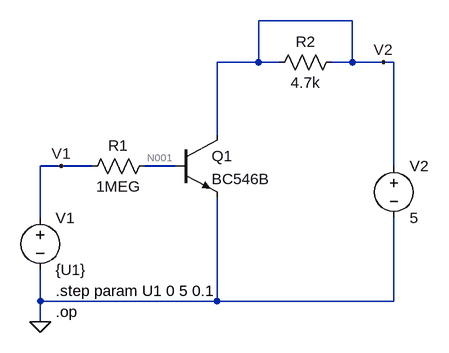
[diagram p0: schematic 1_Ic-Uce-characteristics_nolabels.asc]
1_Ic-Uce-characteristics_nolabels.asc, the LTspice schematic file:
Version 4
SHEET 1 1108 680
WIRE 672 -176 528 -176
WIRE 528 -112 528 -176
WIRE 528 -112 464 -112
WIRE 560 -112 528 -112
WIRE 672 -112 672 -176
WIRE 672 -112 640 -112
WIRE 720 -112 672 -112
WIRE 736 -112 720 -112
WIRE 464 0 464 -112
WIRE 224 48 192 48
WIRE 272 48 224 48
WIRE 400 48 352 48
WIRE 736 48 736 -112
WIRE 192 128 192 48
WIRE 192 256 192 208
WIRE 464 256 464 96
WIRE 464 256 192 256
WIRE 736 256 736 128
WIRE 736 256 464 256
WIRE 192 288 192 256
FLAG 192 288 0
FLAG 224 48 V1
FLAG 720 -112 V2
SYMBOL voltage 192 112 R0
WINDOW 123 0 0 Left 2
WINDOW 39 0 0 Left 2
SYMATTR InstName V1
SYMATTR Value {U1}
SYMBOL npn3 400 0 R0
SYMATTR InstName Q1
SYMATTR Value BC546B
SYMBOL res 368 32 R90
WINDOW 0 0 56 VBottom 2
WINDOW 3 32 56 VTop 2
SYMATTR InstName R1
SYMATTR Value 1MEG
SYMBOL res 656 -128 R90
WINDOW 0 0 56 VBottom 2
WINDOW 3 32 56 VTop 2
SYMATTR InstName R2
SYMATTR Value 4.7k
SYMBOL voltage 736 32 R0
WINDOW 123 0 0 Left 2
WINDOW 39 0 0 Left 2
SYMATTR InstName V2
SYMATTR Value 5
TEXT 216 272 Left 2 !.op
TEXT 216 240 Left 2 !.step param U1 0 5 0.1

The netlist it stands for:
* 1_Ic-Uce-characteristics_nolabels.asc
V1 V1 0 {U1}
Q1 V2 N001 0 0 BC546B
R1 N001 V1 1MEG
R2 V2 V2 4.7k
V2 V2 0 5
.model NPN NPN
.model PNP PNP
.lib standard.bjt
.op
.step param U1 0 5 0.1
.backanno
.end

* Results of the author's LTspice run, read from the files saved beside the schematic
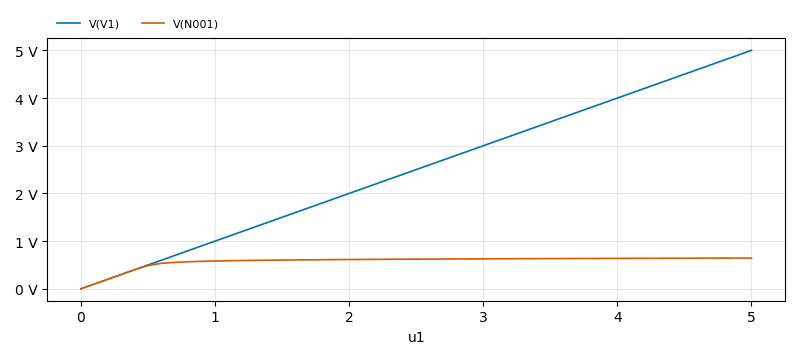
[diagram p1: Operating Point of 1_Ic-Uce-characteristics_nolabels.asc, plotted from the saved traces]
* Operating Point, 1 run:
*   V(V1): 0 V at u1=0, 5 V at u1=5 , min 0 V, max 5 V
*   V(N001): 5.066 µV at u1=0, 644.5 mV at u1=5 , min 5.066 µV, max 644.5 mV
* From the log:
*   Semiconductor Device Operating Points:
*                           --- Bipolar Transistors ---
*   Name:       q1
*   Model:    bc546b
*   Ib:      -5.07e-12
*   Ic:       5.09e-12
*   Vbe:      5.07e-06
*   Vbc:     -5.00e+00
*   Vce:      5.00e+00
*   BetaDC:  -1.00e+00
*   Gm:       9.88e-13
*   Rpi:      9.16e+11
*   Rx:       1.00e+00
*   Ro:       2.64e+15
*   Cbe:      1.36e-11
*   Cbc:      1.07e-12
*   Cjs:      0.00e+00
*   BetaAC:   9.05e-01
*   Cbx:      6.58e-13
*   Ft:       4.83e-03